# EAGLE design D1MTERMINAL (EAGLE 6.5.0)
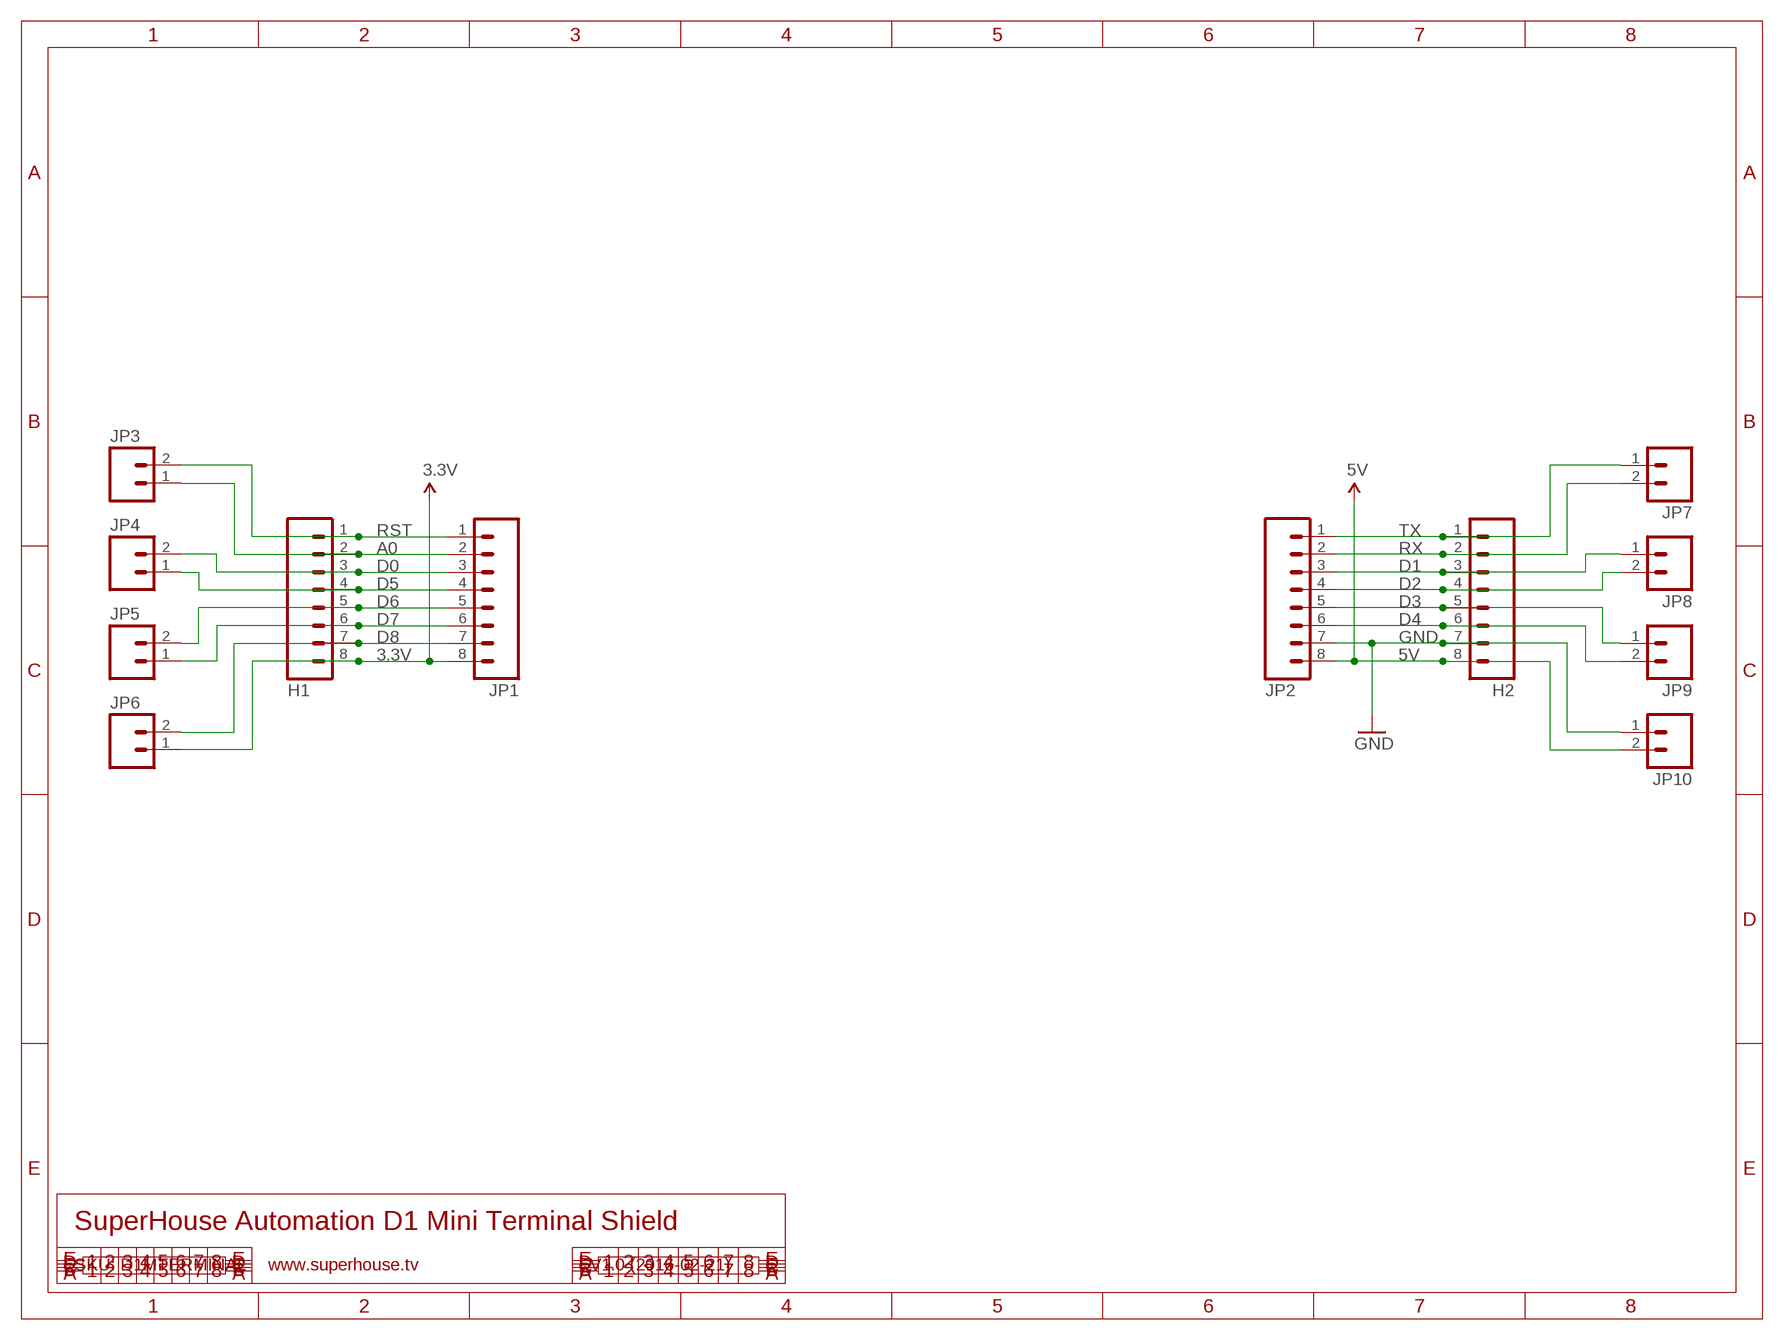
[diagram p0: schematic, sheet 1]

## Parts
H1  M08  [1X08]
H2  M08  [1X08]
JP1  M08  [1X08]
JP2  M08  [1X08]
JP3  M023.5MM  [SCREWTERMINAL-3.5MM-2]
JP4  M023.5MM  [SCREWTERMINAL-3.5MM-2]
JP5  M023.5MM  [SCREWTERMINAL-3.5MM-2]
JP6  M023.5MM  [SCREWTERMINAL-3.5MM-2]
JP7  M023.5MM  [SCREWTERMINAL-3.5MM-2]
JP8  M023.5MM  [SCREWTERMINAL-3.5MM-2]
JP9  M023.5MM  [SCREWTERMINAL-3.5MM-2]
JP10  M023.5MM  [SCREWTERMINAL-3.5MM-2]

## Nets
3.3V: H1.8 JP1.8 JP6.1
5V: H2.8 JP2.8 JP10.2
A0: H1.2 JP1.2 JP3.1
D0: H1.3 JP1.3 JP4.2
D1: H2.3 JP2.3 JP8.1
D2: H2.4 JP2.4 JP8.2
D3: H2.5 JP2.5 JP9.1
D4: H2.6 JP2.6 JP9.2
D5: H1.4 JP1.4 JP4.1
D6: H1.5 JP1.5 JP5.2
D7: H1.6 JP1.6 JP5.1
D8: H1.7 JP1.7 JP6.2
GND: H2.7 JP2.7 JP10.1
RST: H1.1 JP1.1 JP3.2
RX: H2.2 JP2.2 JP7.2
TX: H2.1 JP2.1 JP7.1

## Notes on the sheet
- SuperHouse Automation D1 Mini Terminal Shield
- SKU: D1MTERMINAL | www.superhouse.tv | V1.0 (2016-02-21)

## Library data of the parts
H1 H2 JP1 JP2 = freetronics-original:M08: Header 8 Standard 8-pin 0.1" header. Use with straight break away headers (SKU : PRT-00116), right angle break away headers (PRT-00553), swiss pins (PRT-00743), machine pins (PRT-00117), and female headers (PRT-00115).
JP3-JP10 = freetronics-jon:M02: Header 2 Standard 2-pin 0.1" header. Use with straight break away headers (SKU : PRT-00116), right angle break away headers (PRT-00553), swiss pins (PRT-00743), machine pins (PRT-00117), and female headers (PRT-00115). Molex polarized connector foot print use with SKU : PRT-08233 with associated crimp pins and housings.

## Net classes
0 default: width 0.203 mm, drill 0.356 mm, clearance 0.152 mm
1 power: width 0.203 mm, clearance 0.152 mm

## Board
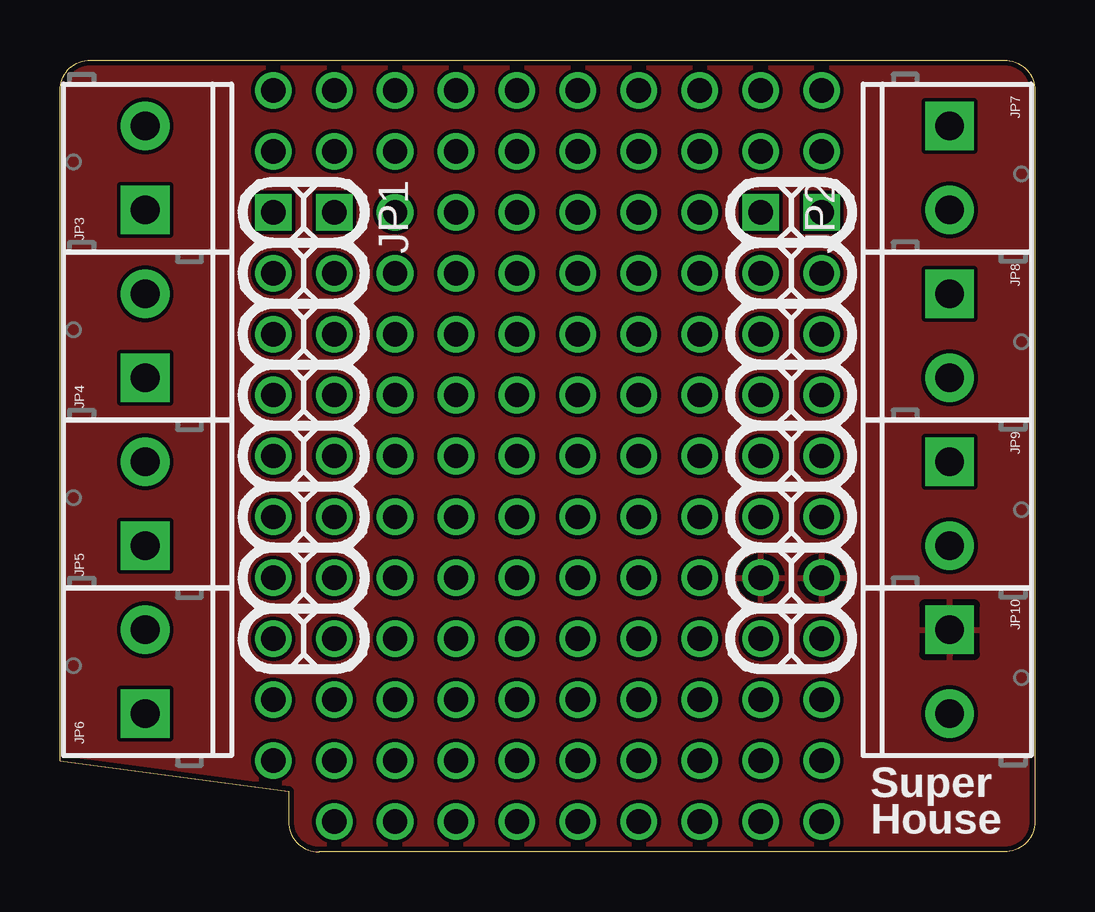
[diagram p1: board, top side]
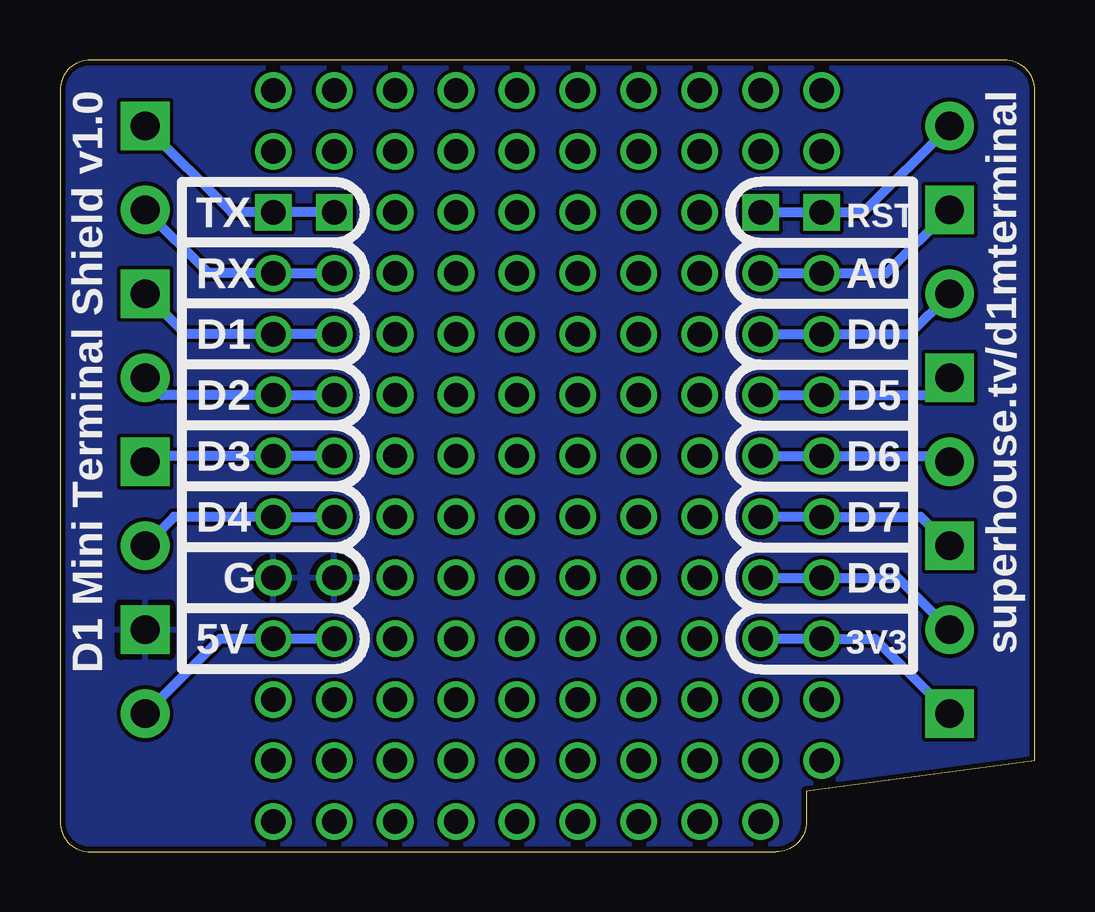
[diagram p2: board, bottom side, seen from below]

Size 40.64 x 33.02 mm. Coordinates in mm from the lower left corner, seen from the top.
Outline: 40.64,31.75 40.64,1.27 arc-90 39.37,0 10.79,0 arc-90 9.53,1.27 9.53,2.54 0,3.81 0,31.75 arc-90 1.27,33.02 39.37,33.02 arc-90 40.64,31.75
Copper layers (1*16): Top 0.035mm / dielectric 1.5mm / Bottom 0.035mm
Design rules "ElectroDragon_2layer_DRU_no_angle_20140221": minimum track width 6mil, minimum drill 12mil, track to track 6mil, track to pad 6mil, pad to pad 6mil, via to via 6mil, smd to smd 6mil, copper to edge 8mil, drill to drill 6mil, minimum pad ring 10mil, minimum via ring 6mil, stop-mask expansion 4mil, vias tented up to drill 100mil, thermal gap 10mil

### Footprints (pad centres in the part's own frame; a part is rotated, then mirrored left to right if it is on the bottom)
1X08 = drill 1.016 square: 1 0,0 | drill 1.016: 2 2.54,0; 3 5.08,0; 4 7.62,0; 5 10.16,0; 6 12.7,0; 7 15.24,0; 8 17.78,0
SCREWTERMINAL-3.5MM-2 = drill 1.2 pad 2.032 square: 1 0,0 | drill 1.2 pad 2.032: 2 3.5,0

### Placement (x,y rotation side)
H1  8.89,26.67 270 top
H2  31.75,26.67 270 top
JP1  11.43,26.67 270 top
JP2  29.21,26.67 270 top
JP3  3.56,26.77 90 top
JP4  3.56,19.77 90 top
JP5  3.56,12.77 90 top
JP6  3.56,5.77 90 top
JP7  37.08,30.27 270 top
JP8  37.08,23.27 270 top
JP9  37.08,16.27 270 top
JP10  37.08,9.27 270 top

### Tracks (layer width: path | path; a pad name or v marks a point on that pad's centre or on a via)
3.3V
  Bottom 0.406: JP1.8 H1.8 6.68,8.89 JP6.1
5V
  Bottom 0.406: JP2.8 H2.8 33.96,8.89 JP10.2
A0
  Bottom 0.406: JP1.2 H1.2 6.2,24.13 JP3.1
D0
  Bottom 0.406: JP1.3 H1.3 5.24,21.59 JP4.2
D1
  Bottom 0.406: JP2.3 H2.3 35.4,21.59 JP8.1
D2
  Bottom 0.406: JP2.4 H2.4 36.36,19.05 JP8.2
D3
  Bottom 0.406: JP2.5 H2.5 36.84,16.51 JP9.1
D4
  Bottom 0.406: JP2.6 H2.6 35.88,13.97 JP9.2
D5
  Bottom 0.406: JP1.4 H1.4 4.28,19.05 JP4.1
D6
  Bottom 0.406: JP1.5 H1.5 3.8,16.51 JP5.2
D7
  Bottom 0.406: JP1.6 H1.6 4.76,13.97 JP5.1
D8
  Bottom 0.406: JP1.7 H1.7 5.72,11.43 JP6.2
GND
  pour Top: 40.64,31.75 arc90 39.37,33.02 1.27,33.02 arc90 0,31.75 0,3.81 9.53,2.54 9.53,1.27 arc90 10.79,0 39.37,0 arc90 40.64,1.27
  pour Bottom: 40.64,1.27 40.64,31.75 arc90 39.37,33.02 1.27,33.02 arc90 0,31.75 0,3.81 9.53,2.54 9.53,1.27 arc90 10.79,0 39.37,0 arc90
N$1  (via drill 1.02)
  other vias: 13.97,26.67
N$2  (via drill 1.02)
  other vias: 13.97,24.13
N$3  (via drill 1.02)
  other vias: 13.97,21.59
N$4  (via drill 1.02)
  other vias: 13.97,19.05
N$5  (via drill 1.02)
  other vias: 13.97,16.51
N$6  (via drill 1.02)
  other vias: 13.97,13.97
N$7  (via drill 1.02)
  other vias: 13.97,11.43
N$8  (via drill 1.02)
  other vias: 13.97,8.89
N$9  (via drill 1.02)
  other vias: 13.97,6.35
N$10  (via drill 1.02)
  other vias: 13.97,3.81
N$11  (via drill 1.02)
  other vias: 13.97,1.27
N$12  (via drill 1.02)
  other vias: 11.43,1.27
N$13  (via drill 1.02)
  other vias: 11.43,3.81
N$14  (via drill 1.02)
  other vias: 11.43,6.35
N$15  (via drill 1.02)
  other vias: 11.43,29.21
N$16  (via drill 1.02)
  other vias: 13.97,29.21
N$17  (via drill 1.02)
  other vias: 13.97,31.75
N$18  (via drill 1.02)
  other vias: 11.43,31.75
N$19  (via drill 1.02)
  other vias: 8.89,29.21
N$20  (via drill 1.02)
  other vias: 8.89,31.75
N$21  (via drill 1.02)
  other vias: 31.75,29.21
N$22  (via drill 1.02)
  other vias: 31.75,31.75
N$23  (via drill 1.02)
  other vias: 31.75,6.35
N$24  (via drill 1.02)
  other vias: 31.75,3.81
N$25  (via drill 1.02)
  other vias: 31.75,1.27
N$26  (via drill 1.02)
  other vias: 16.51,26.67
N$27  (via drill 1.02)
  other vias: 16.51,24.13
N$28  (via drill 1.02)
  other vias: 16.51,21.59
N$29  (via drill 1.02)
  other vias: 16.51,19.05
N$30  (via drill 1.02)
  other vias: 16.51,16.51
N$31  (via drill 1.02)
  other vias: 16.51,13.97
N$32  (via drill 1.02)
  other vias: 16.51,11.43
N$33  (via drill 1.02)
  other vias: 16.51,8.89
N$34  (via drill 1.02)
  other vias: 16.51,6.35
N$35  (via drill 1.02)
  other vias: 16.51,3.81
N$36  (via drill 1.02)
  other vias: 16.51,1.27
N$37  (via drill 1.02)
  other vias: 16.51,29.21
N$38  (via drill 1.02)
  other vias: 16.51,31.75
N$39  (via drill 1.02)
  other vias: 19.05,26.67
N$40  (via drill 1.02)
  other vias: 19.05,24.13
N$41  (via drill 1.02)
  other vias: 19.05,21.59
N$42  (via drill 1.02)
  other vias: 19.05,19.05
N$43  (via drill 1.02)
  other vias: 19.05,16.51
N$44  (via drill 1.02)
  other vias: 19.05,13.97
N$45  (via drill 1.02)
  other vias: 19.05,11.43
N$46  (via drill 1.02)
  other vias: 19.05,8.89
N$47  (via drill 1.02)
  other vias: 19.05,6.35
N$48  (via drill 1.02)
  other vias: 19.05,3.81
N$49  (via drill 1.02)
  other vias: 19.05,1.27
N$50  (via drill 1.02)
  other vias: 19.05,29.21
N$51  (via drill 1.02)
  other vias: 19.05,31.75
N$52  (via drill 1.02)
  other vias: 21.59,26.67
N$53  (via drill 1.02)
  other vias: 21.59,24.13
N$54  (via drill 1.02)
  other vias: 21.59,21.59
N$55  (via drill 1.02)
  other vias: 21.59,19.05
N$56  (via drill 1.02)
  other vias: 21.59,16.51
N$57  (via drill 1.02)
  other vias: 21.59,13.97
N$58  (via drill 1.02)
  other vias: 21.59,11.43
N$59  (via drill 1.02)
  other vias: 21.59,8.89
N$60  (via drill 1.02)
  other vias: 21.59,6.35
N$61  (via drill 1.02)
  other vias: 21.59,3.81
N$62  (via drill 1.02)
  other vias: 21.59,1.27
N$63  (via drill 1.02)
  other vias: 21.59,29.21
N$64  (via drill 1.02)
  other vias: 21.59,31.75
N$65  (via drill 1.02)
  other vias: 24.13,26.67
N$66  (via drill 1.02)
  other vias: 24.13,24.13
N$67  (via drill 1.02)
  other vias: 24.13,21.59
N$68  (via drill 1.02)
  other vias: 24.13,19.05
N$69  (via drill 1.02)
  other vias: 24.13,16.51
N$70  (via drill 1.02)
  other vias: 24.13,13.97
N$71  (via drill 1.02)
  other vias: 24.13,11.43
N$72  (via drill 1.02)
  other vias: 24.13,8.89
N$73  (via drill 1.02)
  other vias: 24.13,6.35
N$74  (via drill 1.02)
  other vias: 24.13,3.81
N$75  (via drill 1.02)
  other vias: 24.13,1.27
N$76  (via drill 1.02)
  other vias: 24.13,29.21
N$77  (via drill 1.02)
  other vias: 24.13,31.75
N$78  (via drill 1.02)
  other vias: 26.67,26.67
N$79  (via drill 1.02)
  other vias: 26.67,24.13
N$80  (via drill 1.02)
  other vias: 26.67,21.59
N$81  (via drill 1.02)
  other vias: 26.67,19.05
N$82  (via drill 1.02)
  other vias: 26.67,16.51
N$83  (via drill 1.02)
  other vias: 26.67,13.97
N$84  (via drill 1.02)
  other vias: 26.67,11.43
N$85  (via drill 1.02)
  other vias: 26.67,8.89
N$86  (via drill 1.02)
  other vias: 26.67,6.35
N$87  (via drill 1.02)
  other vias: 26.67,3.81
N$88  (via drill 1.02)
  other vias: 26.67,1.27
N$89  (via drill 1.02)
  other vias: 26.67,29.21
N$90  (via drill 1.02)
  other vias: 26.67,31.75
N$91  (via drill 1.02)
  other vias: 29.21,29.21
N$92  (via drill 1.02)
  other vias: 29.21,31.75
N$93  (via drill 1.02)
  other vias: 29.21,6.35
N$94  (via drill 1.02)
  other vias: 29.21,3.81
N$95  (via drill 1.02)
  other vias: 29.21,1.27
N$96  (via drill 1.02)
  other vias: 8.89,6.35
N$97  (via drill 1.02)
  other vias: 8.89,3.81
N$98  (via drill 1.02)
  other vias: 49.53,26.67
N$99  (via drill 1.02)
  other vias: 49.53,24.13
N$100  (via drill 1.02)
  other vias: 49.53,21.59
N$101  (via drill 1.02)
  other vias: 49.53,19.05
N$102  (via drill 1.02)
  other vias: 49.53,16.51
N$103  (via drill 1.02)
  other vias: 49.53,13.97
N$104  (via drill 1.02)
  other vias: 49.53,11.43
N$105  (via drill 1.02)
  other vias: 49.53,8.89
N$106  (via drill 1.02)
  other vias: 49.53,6.35
N$107  (via drill 1.02)
  other vias: 49.53,3.81
N$108  (via drill 1.02)
  other vias: 49.53,29.21
N$109  (via drill 1.02)
  other vias: 49.53,31.75
N$110  (via drill 1.02)
  other vias: 52.07,26.67
N$111  (via drill 1.02)
  other vias: 52.07,24.13
N$112  (via drill 1.02)
  other vias: 52.07,21.59
N$113  (via drill 1.02)
  other vias: 52.07,19.05
N$114  (via drill 1.02)
  other vias: 52.07,16.51
N$115  (via drill 1.02)
  other vias: 52.07,13.97
N$116  (via drill 1.02)
  other vias: 52.07,11.43
N$117  (via drill 1.02)
  other vias: 52.07,8.89
N$118  (via drill 1.02)
  other vias: 52.07,6.35
N$119  (via drill 1.02)
  other vias: 52.07,3.81
N$120  (via drill 1.02)
  other vias: 52.07,29.21
N$121  (via drill 1.02)
  other vias: 52.07,31.75
N$122  (via drill 1.02)
  other vias: 54.61,26.67
N$123  (via drill 1.02)
  other vias: 54.61,24.13
N$124  (via drill 1.02)
  other vias: 54.61,21.59
N$125  (via drill 1.02)
  other vias: 54.61,19.05
N$126  (via drill 1.02)
  other vias: 54.61,16.51
N$127  (via drill 1.02)
  other vias: 54.61,13.97
N$128  (via drill 1.02)
  other vias: 54.61,11.43
N$129  (via drill 1.02)
  other vias: 54.61,8.89
N$130  (via drill 1.02)
  other vias: 54.61,6.35
N$131  (via drill 1.02)
  other vias: 54.61,3.81
N$132  (via drill 1.02)
  other vias: 54.61,29.21
N$133  (via drill 1.02)
  other vias: 54.61,31.75
N$134  (via drill 1.02)
  other vias: 57.15,26.67
N$135  (via drill 1.02)
  other vias: 57.15,24.13
N$136  (via drill 1.02)
  other vias: 57.15,21.59
N$137  (via drill 1.02)
  other vias: 57.15,19.05
N$138  (via drill 1.02)
  other vias: 57.15,16.51
N$139  (via drill 1.02)
  other vias: 57.15,13.97
N$140  (via drill 1.02)
  other vias: 57.15,11.43
N$141  (via drill 1.02)
  other vias: 57.15,8.89
N$142  (via drill 1.02)
  other vias: 57.15,6.35
N$143  (via drill 1.02)
  other vias: 57.15,3.81
N$144  (via drill 1.02)
  other vias: 57.15,29.21
N$145  (via drill 1.02)
  other vias: 57.15,31.75
N$146  (via drill 1.02)
  other vias: 49.53,1.27
N$147  (via drill 1.02)
  other vias: 52.07,1.27
N$148  (via drill 1.02)
  other vias: 54.61,1.27
N$149  (via drill 1.02)
  other vias: 57.15,1.27
N$150  (via drill 1.02)
  other vias: 59.69,26.67
N$151  (via drill 1.02)
  other vias: 59.69,24.13
N$152  (via drill 1.02)
  other vias: 59.69,21.59
N$153  (via drill 1.02)
  other vias: 59.69,19.05
N$154  (via drill 1.02)
  other vias: 59.69,16.51
N$155  (via drill 1.02)
  other vias: 59.69,13.97
N$156  (via drill 1.02)
  other vias: 59.69,11.43
N$157  (via drill 1.02)
  other vias: 59.69,8.89
N$158  (via drill 1.02)
  other vias: 59.69,6.35
N$159  (via drill 1.02)
  other vias: 59.69,3.81
N$160  (via drill 1.02)
  other vias: 59.69,29.21
N$161  (via drill 1.02)
  other vias: 59.69,31.75
N$162  (via drill 1.02)
  other vias: 62.23,26.67
N$163  (via drill 1.02)
  other vias: 62.23,24.13
N$164  (via drill 1.02)
  other vias: 62.23,21.59
N$165  (via drill 1.02)
  other vias: 62.23,19.05
N$166  (via drill 1.02)
  other vias: 62.23,16.51
N$167  (via drill 1.02)
  other vias: 62.23,13.97
N$168  (via drill 1.02)
  other vias: 62.23,11.43
N$169  (via drill 1.02)
  other vias: 62.23,8.89
N$170  (via drill 1.02)
  other vias: 62.23,6.35
N$171  (via drill 1.02)
  other vias: 62.23,3.81
N$172  (via drill 1.02)
  other vias: 62.23,29.21
N$173  (via drill 1.02)
  other vias: 62.23,31.75
N$174  (via drill 1.02)
  other vias: 59.69,1.27
N$175  (via drill 1.02)
  other vias: 62.23,1.27
N$176  (via drill 1.02)
  other vias: 64.77,29.21
N$177  (via drill 1.02)
  other vias: 64.77,31.75
N$178  (via drill 1.02)
  other vias: 67.31,29.21
N$179  (via drill 1.02)
  other vias: 67.31,31.75
N$180  (via drill 1.02)
  other vias: 64.77,6.35
N$181  (via drill 1.02)
  other vias: 64.77,3.81
N$182  (via drill 1.02)
  other vias: 67.31,6.35
N$183  (via drill 1.02)
  other vias: 67.31,3.81
N$184  (via drill 1.02)
  other vias: 64.77,1.27
N$185  (via drill 1.02)
  other vias: 67.31,1.27
N$186  (via drill 1.02)
  other vias: 44.45,6.35
N$187  (via drill 1.02)
  other vias: 44.45,3.81
N$188  (via drill 1.02)
  other vias: 46.99,6.35
N$189  (via drill 1.02)
  other vias: 46.99,3.81
N$191  (via drill 1.02)
  other vias: 46.99,1.27
N$192  (via drill 1.02)
  other vias: 44.45,29.21
N$193  (via drill 1.02)
  other vias: 44.45,31.75
N$194  (via drill 1.02)
  other vias: 46.99,29.21
N$195  (via drill 1.02)
  other vias: 46.99,31.75
RST
  Bottom 0.406: JP1.1 H1.1 7.16,26.67 JP3.2
RX
  Bottom 0.406: JP2.2 H2.2 34.44,24.13 JP7.2
TX
  Bottom 0.406: JP2.1 H2.1 33.48,26.67 JP7.1

### Text on the board
tPlace: Super / House
bPlace: superhouse.tv/d1mterminal | D1 Mini Terminal Shield v1.0 | RST | TX | A0 | RX | D0 | D1 | D5 | D2 | D6 | D3 | D7 | D4 | D8 | G | 3V3 | 5V